# EAGLE design Control_vivero (EAGLE 9.6.1)

## Sheet 1 of 3
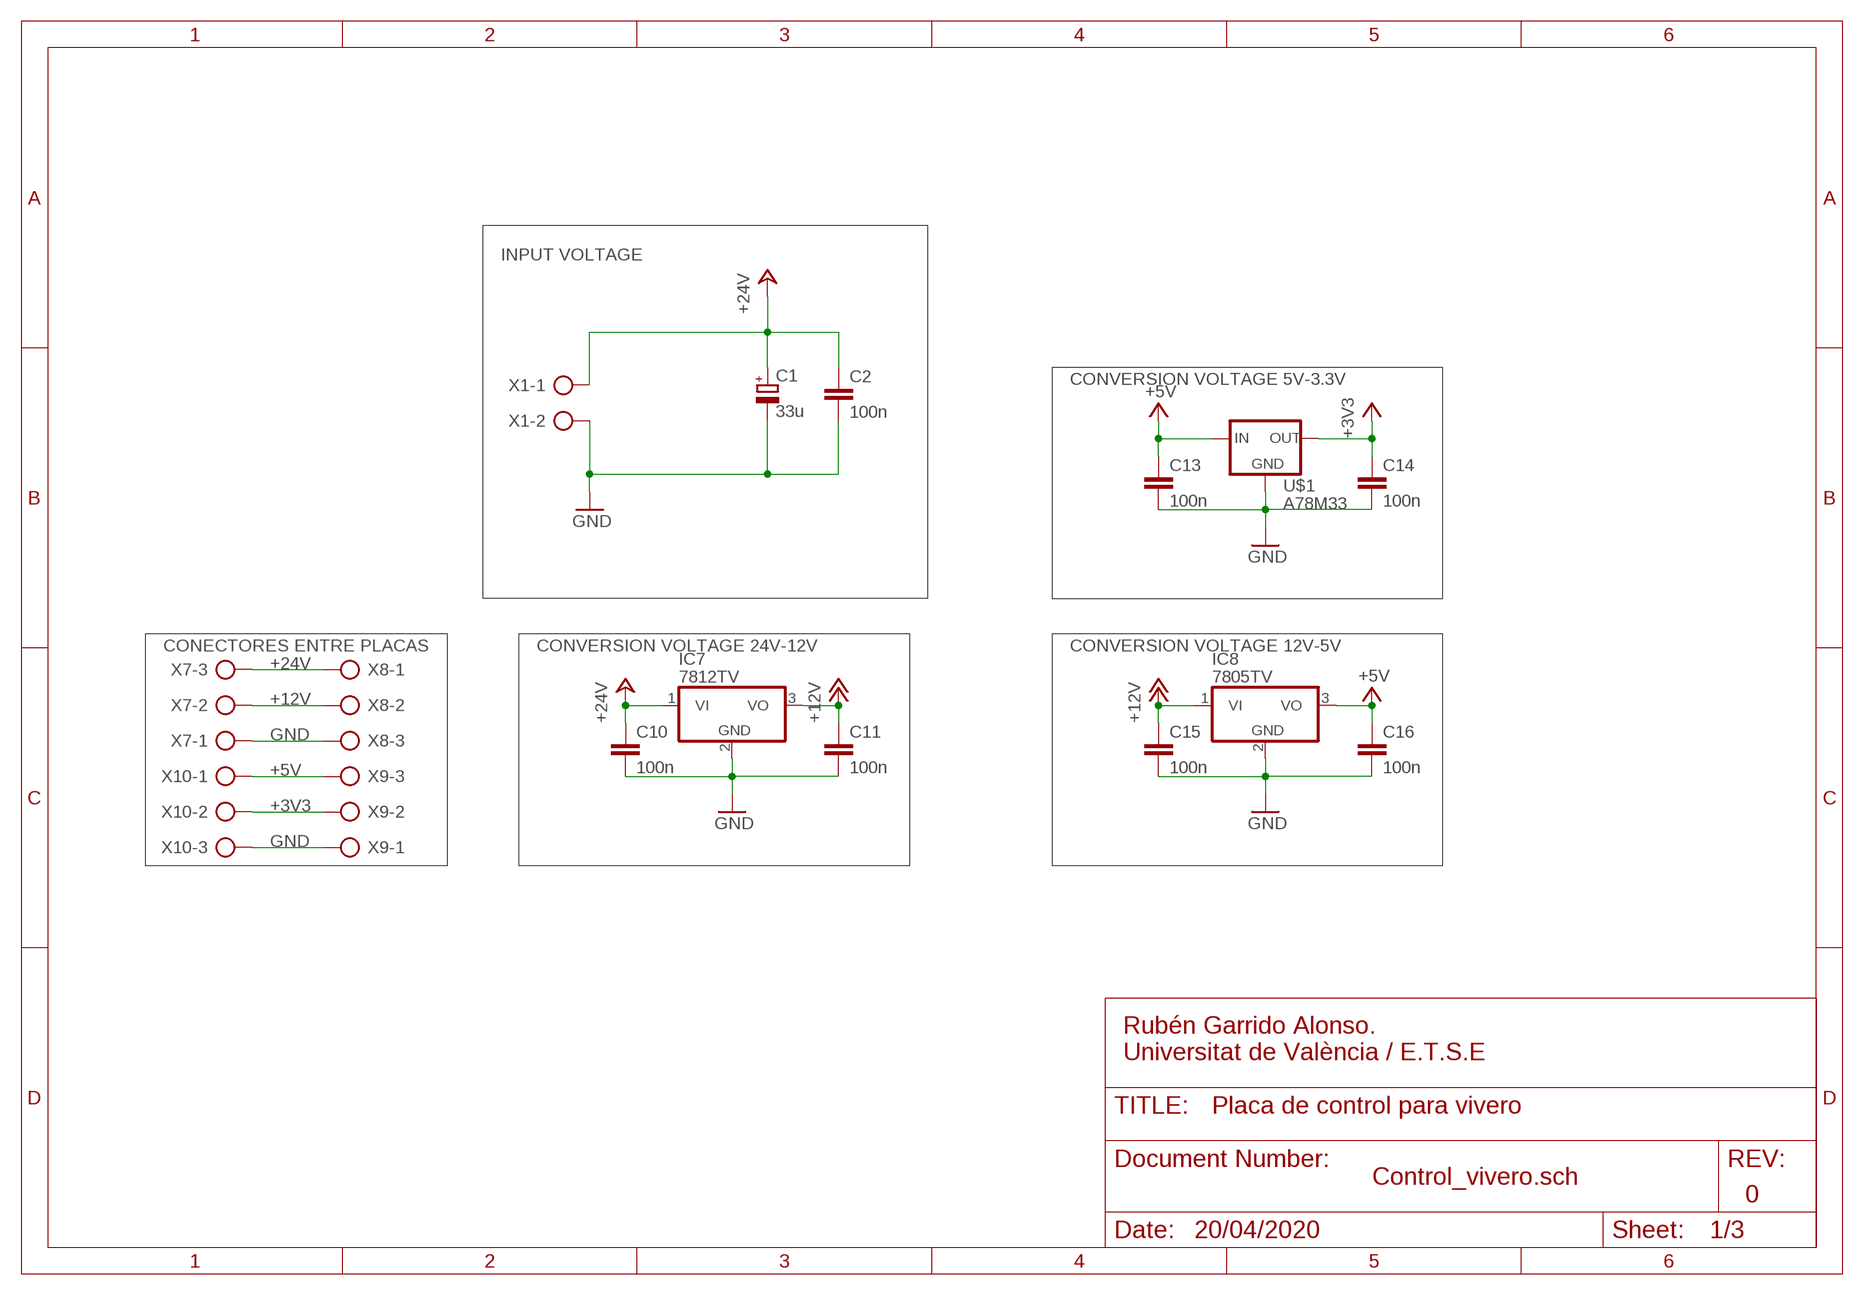
[diagram p0: schematic, sheet 1]

### Parts
C1  33u  CPOL-EUE2.5-7  [E2,5-7]
C2  100n  C-EU050-025X075  [C050-025X075]
C10  100n  C-EU050-025X075  [C050-025X075]
C11  100n  C-EU050-025X075  [C050-025X075]
C13  100n  C-EU050-025X075  [C050-025X075]
C14  100n  C-EU050-025X075  [C050-025X075]
C15  100n  C-EU050-025X075  [C050-025X075]
C16  100n  C-EU050-025X075  [C050-025X075]
IC7  7812TV  [TO220V]
IC8  7805TV  [TO220V]
U$1  A78M33  [TO-252]
X1  AK500/2-H  [AK500/2-H]
X7  AK300/3  [AK300/3]
X8  AK300/3  [AK300/3]
X9  AK300/3  [AK300/3]
X10  AK300/3  [AK300/3]

### Nets
+3V3: C14.1 U$1.OUT X9.2 X10.2 ; also sheet 3
+5V: C13.1 C16.1 IC8.3(VO) U$1.IN X9.3 X10.1 ; also sheet 2
+12V: C11.1 C15.1 IC7.3(VO) IC8.1(VI) X7.2 X8.2 ; also sheet 3
+24V: C1.+ C2.1 C10.1 IC7.1(VI) X1.1 X7.3 X8.1 ; also sheet 3
GND: C1.- C2.2 C10.2 C11.2 C13.2 C14.2 C15.2 C16.2 IC7.2(GND) IC8.2(GND) U$1.COM(GND) X1.2 X7.1 X8.3 X9.1 X10.3 ; also sheet 2,3

### Notes on the sheet
- INPUT VOLTAGE
- CONVERSION VOLTAGE 5V-3.3V
- CONECTORES ENTRE PLACAS | CONVERSION VOLTAGE 24V-12V | CONVERSION VOLTAGE 12V-5V
- Rubén Garrido Alonso.
  Universitat de València / E.T.S.E
- Placa de control para vivero
- Control_vivero.sch
- 0
- 20/04/2020

## Sheet 2 of 3
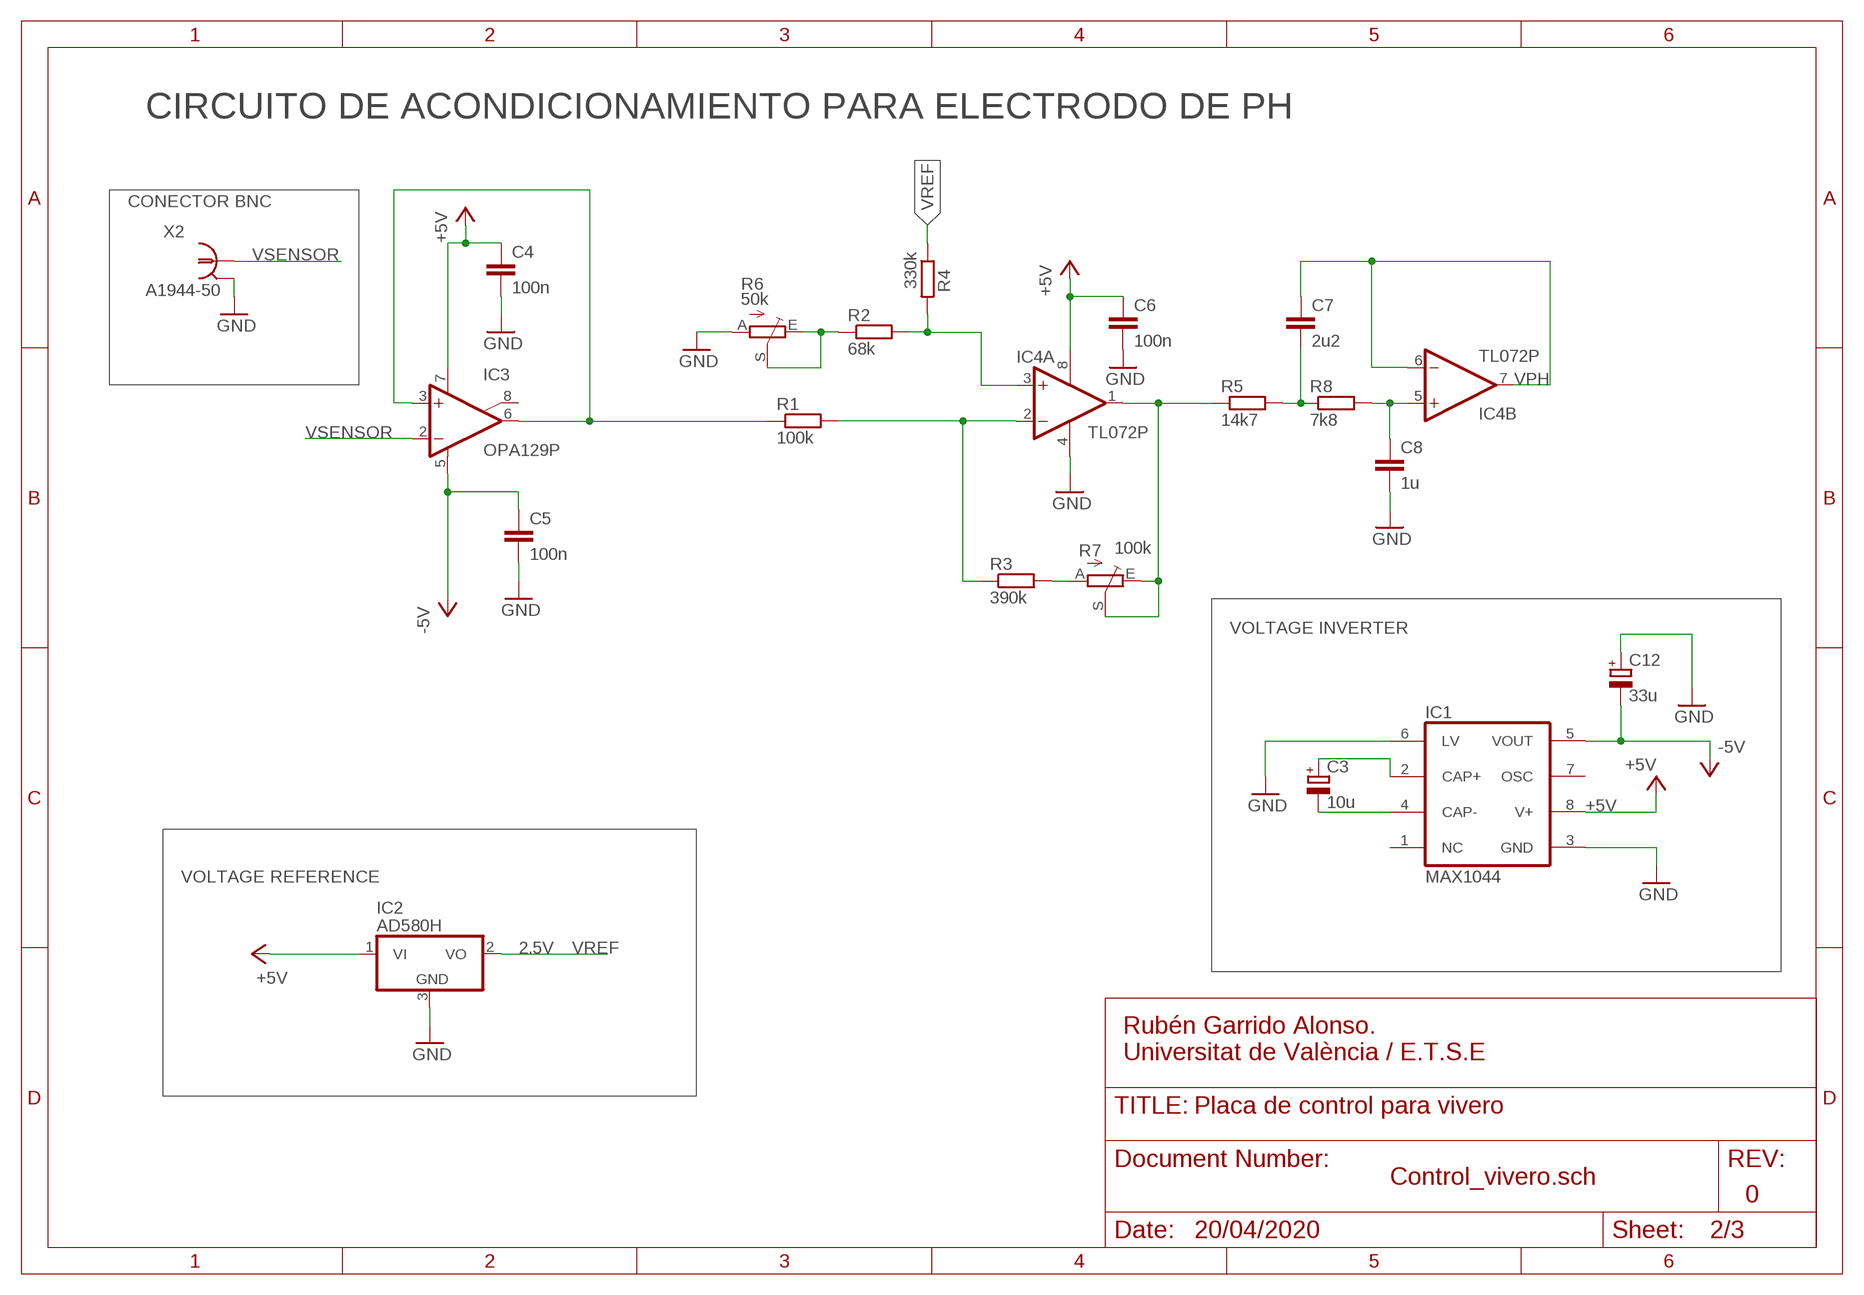
[diagram p1: schematic, sheet 2]

### Parts
C3  10u  CPOL-EUE2,5-6E  [E2,5-6E]
C4  100n  C-EU050-025X075  [C050-025X075]
C5  100n  C-EU050-025X075  [C050-025X075]
C6  100n  C-EU050-025X075  [C050-025X075]
C7  2u2  C-EU050-055X075  [C050-055X075]
C8  1u  C-EU050-055X075  [C050-055X075]
C12  33u  CPOL-EUE2,5-6E  [E2,5-6E]
IC1  MAX1044  [DIL08]
IC2  AD580H  [TO39]
IC3  OPA129P  [DIL08]
IC4  TL072P  [DIL08]
R1  100k  R-EU_0207/10  [0207/10]
R2  68k  R-EU_0207/10  [0207/10]
R3  390k  R-EU_0207/10  [0207/10]
R4  330k  R-EU_0207/10  [0207/10]
R5  14k7  R-EU_0207/10  [0207/10]
R6  50k  TRIM_EU-B25P  [B25P]
R7  100k  TRIM_EU-B25P  [B25P]
R8  7k8  R-EU_0207/10  [0207/10]
X2  A1944-50  [A1944]

### Nets
+5V: C4.1 C6.1 IC1.8(V+) IC2.1(VI) IC3.7(V+) IC4.8(P:V+) ; also sheet 1
-5V: C5.1 C12.- IC1.5(VOUT) IC3.5(V-)
GND: C4.2 C5.2 C6.2 C8.2 C12.+ IC1.3(GND) IC1.6(LV) IC2.3(GND) IC4.4(P:V-) R6.A X2.2 X2.3 X2.4 X2.5 ; also sheet 1,3
N$1: C3.+ IC1.2(CAP+)
N$2: C3.- IC1.4(CAP-)
N$3: R3.2 R7.A
N$4: IC3.3(+IN) IC3.6(OUT) R1.1
N$6: IC4.1(A:OUT) R5.1 R7.E R7.S
N$7: IC4.3(A:+IN) R2.2 R4.2
N$8: R2.1 R6.E R6.S
N$9: C7.2 R5.2 R8.1
N$10: C8.1 IC4.5(B:+IN) R8.2
N$16: IC4.2(A:-IN) R1.2 R3.1
VPH: C7.1 IC4.6(B:-IN) IC4.7(B:OUT) ; also sheet 3
VREF: IC2.2(VO) R4.1
VSENSOR: IC3.2(-IN) X2.1
Unconnected: IC1.1(NC) IC1.7(OSC) IC3.8(SUBS)

### Notes on the sheet
- CIRCUITO DE ACONDICIONAMIENTO PARA ELECTRODO DE PH
- CONECTOR BNC
- VOLTAGE INVERTER
- VOLTAGE REFERENCE
- 2.5V
- Rubén Garrido Alonso.
  Universitat de València / E.T.S.E
- Placa de control para vivero
- Control_vivero.sch
- 0
- 20/04/2020

## Sheet 3 of 3
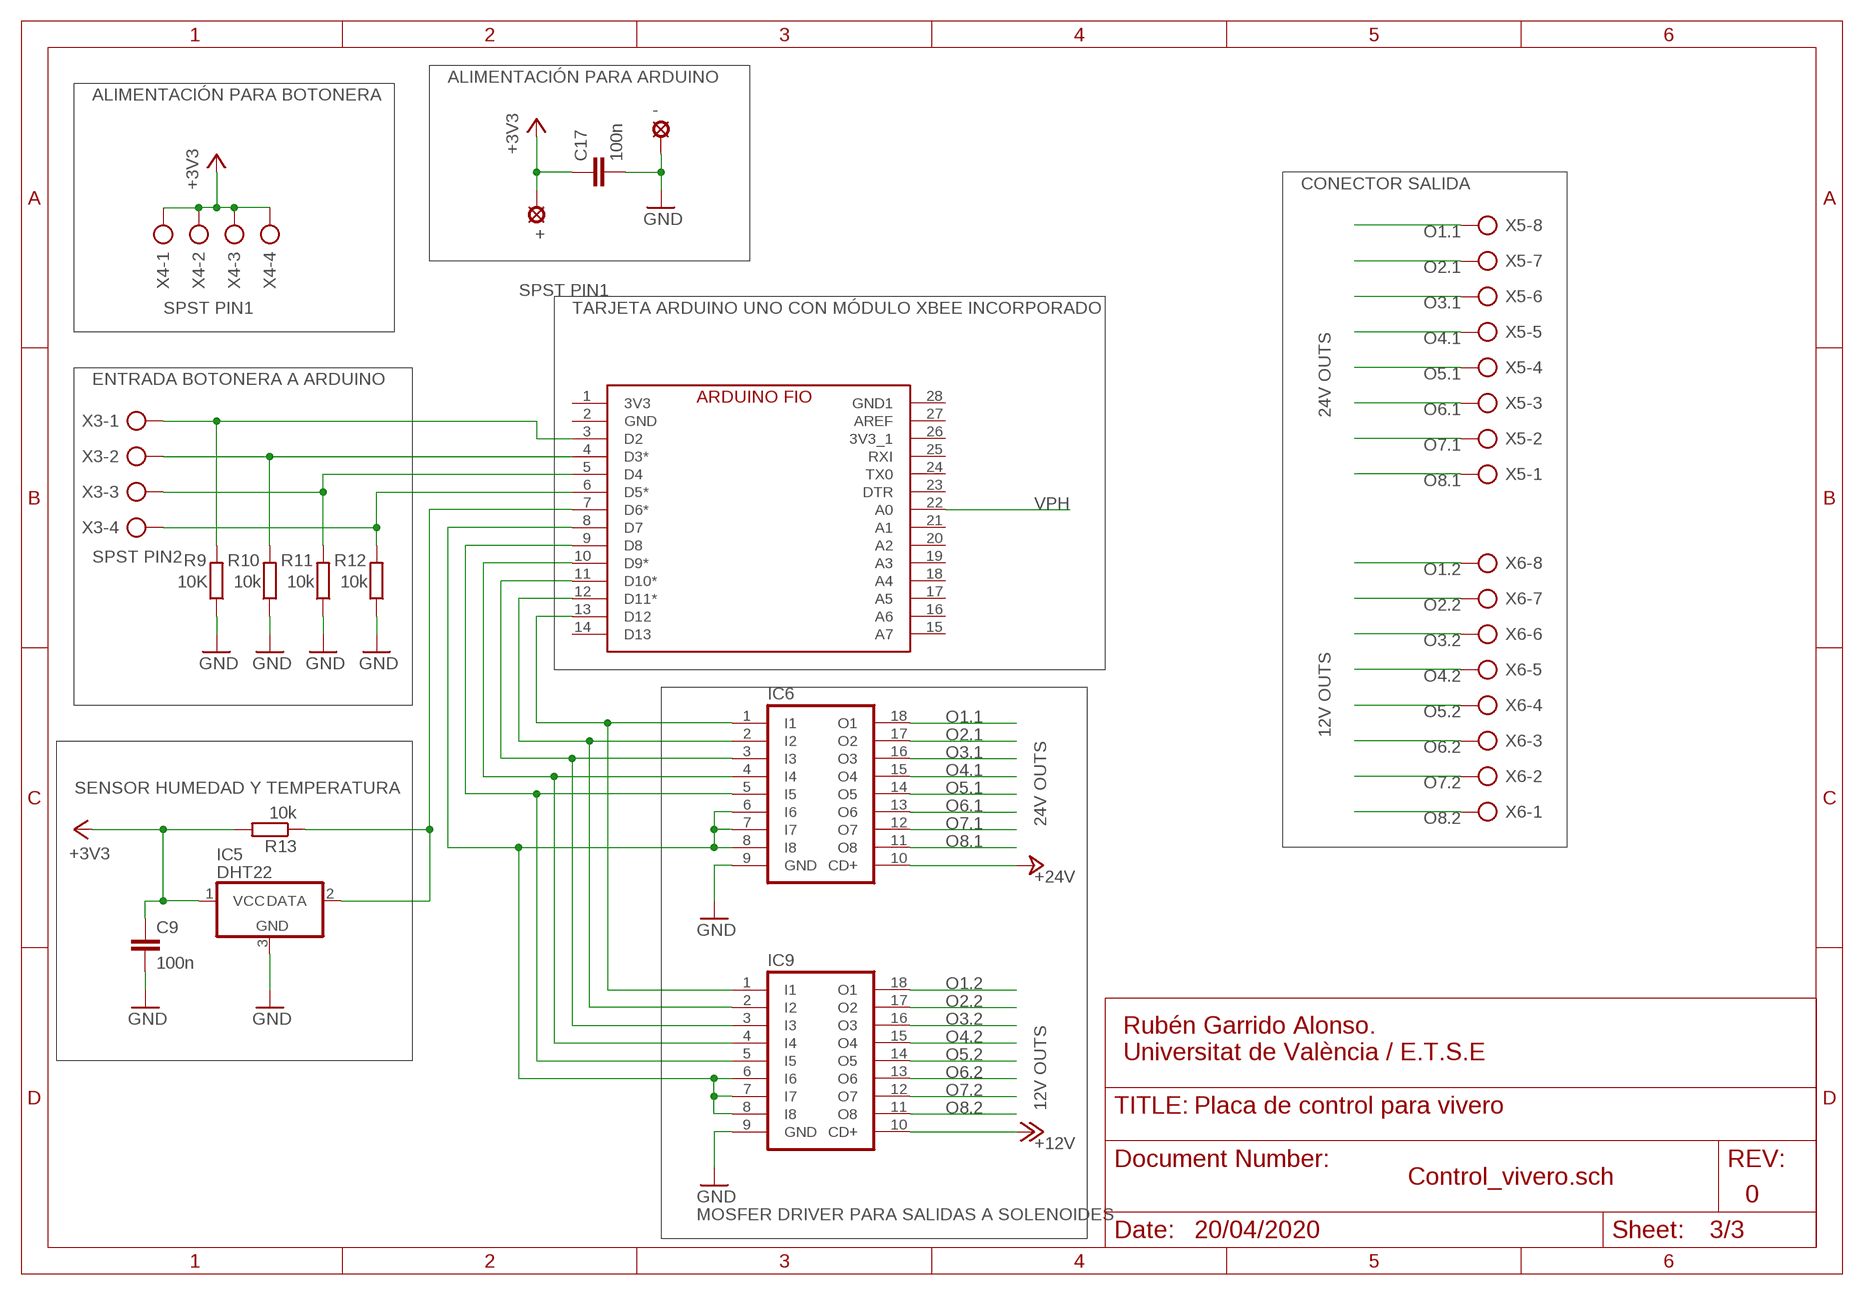
[diagram p2: schematic, sheet 3]

### Parts
+  LSP10  [LSP10]
-  LSP10  [LSP10]
B1  ARDUINO_FIO  [ARDUINO_FIO_SOCKET]
C9  100n  C-EU050-025X075  [C050-025X075]
C17  100n  C-EU050-025X075  [C050-025X075]
IC5  DHT22  [AK300/3]
IC6  ULN2803A  [DIL18]
IC9  ULN2803A  [DIL18]
R9  10K  R-EU_0207/10  [0207/10]
R10  10k  R-EU_0207/10  [0207/10]
R11  10k  R-EU_0207/10  [0207/10]
R12  10k  R-EU_0207/10  [0207/10]
R13  10k  R-EU_0207/10  [0207/10]
X3  AK300/4  [AK300/4]
X4  AK300/4  [AK300/4]
X5  AK300/8  [AK300/8]
X6  AK300/8  [AK300/8]

### Nets
+3V3: +.MP C9.1 C17.1 IC5.1(VCC) R13.2 X4.1 X4.2 X4.3 X4.4 ; also sheet 1
+12V: IC9.10(CD+) ; also sheet 1
+24V: IC6.10(CD+) ; also sheet 1
GND: -.MP C9.2 C17.2 IC5.3(GND) IC6.9(GND) IC9.9(GND) R9.1 R10.1 R11.1 R12.1 ; also sheet 1,2
N$11: B1.3(D2) R9.2 X3.1
N$12: B1.4(D3*) R10.2 X3.2
N$14: B1.5(D4) R11.2 X3.3
N$15: B1.6(D5*) R12.2 X3.4
N$17: B1.7(D6*) IC5.2(DATA) R13.1
N$21: B1.8(D7) IC6.6(I6) IC6.7(I7) IC6.8(I8) IC9.6(I6) IC9.7(I7) IC9.8(I8)
N$22: B1.10(D9*) IC6.4(I4) IC9.4(I4)
N$23: B1.9(D8) IC6.5(I5) IC9.5(I5)
N$25: B1.11(D10*) IC6.3(I3) IC9.3(I3)
N$28: B1.12(D11*) IC6.2(I2) IC9.2(I2)
N$29: B1.13(D12) IC6.1(I1) IC9.1(I1)
O1.1: IC6.18(O1) X5.8
O1.2: IC9.18(O1) X6.8
O2.1: IC6.17(O2) X5.7
O2.2: IC9.17(O2) X6.7
O3.1: IC6.16(O3) X5.6
O3.2: IC9.16(O3) X6.6
O4.1: IC6.15(O4) X5.5
O4.2: IC9.15(O4) X6.5
O5.1: IC6.14(O5) X5.4
O5.2: IC9.14(O5) X6.4
O6.1: IC6.13(O6) X5.3
O6.2: IC9.13(O6) X6.3
O7.1: IC6.12(O7) X5.2
O7.2: IC9.12(O7) X6.2
O8.1: IC6.11(O8) X5.1
O8.2: IC9.11(O8) X6.1
VPH: B1.22(A0) ; also sheet 2
Unconnected: B1.1(3V3) B1.2(GND) B1.14(D13) B1.15(A7) B1.16(A6) B1.17(A5) B1.18(A4) B1.19(A3) B1.20(A2) B1.21(A1) B1.23(DTR) B1.24(TX0) B1.25(RXI) B1.26(3V3_1) B1.27(AREF) B1.28(GND1)

### Notes on the sheet
- ALIMENTACIÓN PARA ARDUINO
- ALIMENTACIÓN PARA BOTONERA
- CONECTOR SALIDA
- SPST PIN1
- SPST PIN1 | TARJETA ARDUINO UNO CON MÓDULO XBEE INCORPORADO
- 24V OUTS
- ENTRADA BOTONERA A ARDUINO
- SPST PIN2
- 12V OUTS
- 24V OUTS
- SENSOR HUMEDAD Y TEMPERATURA
- 12V OUTS
- Rubén Garrido Alonso.
  Universitat de València / E.T.S.E
- Placa de control para vivero
- Control_vivero.sch
- 0
- MOSFER DRIVER PARA SALIDAS A SOLENOIDES
- 20/04/2020

## Library data of the parts
+ - = solpad:LSP10: SOLDER PAD drill 1.0 mm, distributor Buerklin, 12H555
B1 = Componentes_PCB_vivero:ARDUINO_FIO
C1 C3 C12 = rcl:CPOL-EU: POLARIZED CAPACITOR, European symbol; SPICEPREFIX: C
C2 C4-C11 C13-C17 = rcl:C-EU: CAPACITOR, European symbol; SPICEPREFIX: C
IC1 = Componentes_PCB_vivero:MAX1044: VOLTAGE CONVERTER; MF: INTERSIL; MPN: ICL7660CPA; OC_FARNELL: 1018170; OC_NEWARK: 06F7441
IC2 = Componentes_PCB_vivero:AD580H: VOLTAGE REFERENCE 2.5 V
IC3 = burr-brown:OPA129: Difet Operational Amplifier Ultra-Low Bias Current; OC_FARNELL: unknown; OC_NEWARK: unknown
IC4 = linear:TL072: OP AMP
IC5 = Componentes_PCB_vivero:DHT22: VOLTAGE REFERENCE 2.5 V
IC6 IC9 = uln-udn:ULN2803A: DRIVER ARRAY
IC7 IC8 = linear:78*: Positive VOLTAGE REGULATOR Source: http://cache.national.com/ds/LM/LM78L05.pdf http://www.fairchildsemi.com/ds/LM/LM7805.pdf
R1-R5 R8-R13 = rcl:R-EU_: RESISTOR, European symbol; SPICEPREFIX: R
R6 R7 = pot:TRIM_EU-: POTENTIOMETER
U$1 = Componentes_PCB_vivero:A78M33
X1 = con-ptr500:AK500/2-H: CONNECTOR Aug. 2004 / PTR Meßtechnik: Die Bezeichnung der Serie AK505 wurde geändert. Es handelt sich hierbei um AK500 in horizontaler Ausführung.; OC_FARNELL: unknown; OC_NEWARK: unknown
X2 = con-coax:A1944-50: BNC CONNECTOR 50 Ohm distributor Buerklin 78F2475; OC_FARNELL: unknown; OC_NEWARK: unknown
X3 X4 = con-ptr500:AK300/4: CONNECTOR; OC_FARNELL: unknown; OC_NEWARK: unknown
X5 X6 = con-ptr500:AK300/8: CONNECTOR; OC_FARNELL: unknown; OC_NEWARK: unknown
X7-X10 = con-ptr500:AK300/3: CONNECTOR; OC_FARNELL: unknown; OC_NEWARK: unknown

## Board
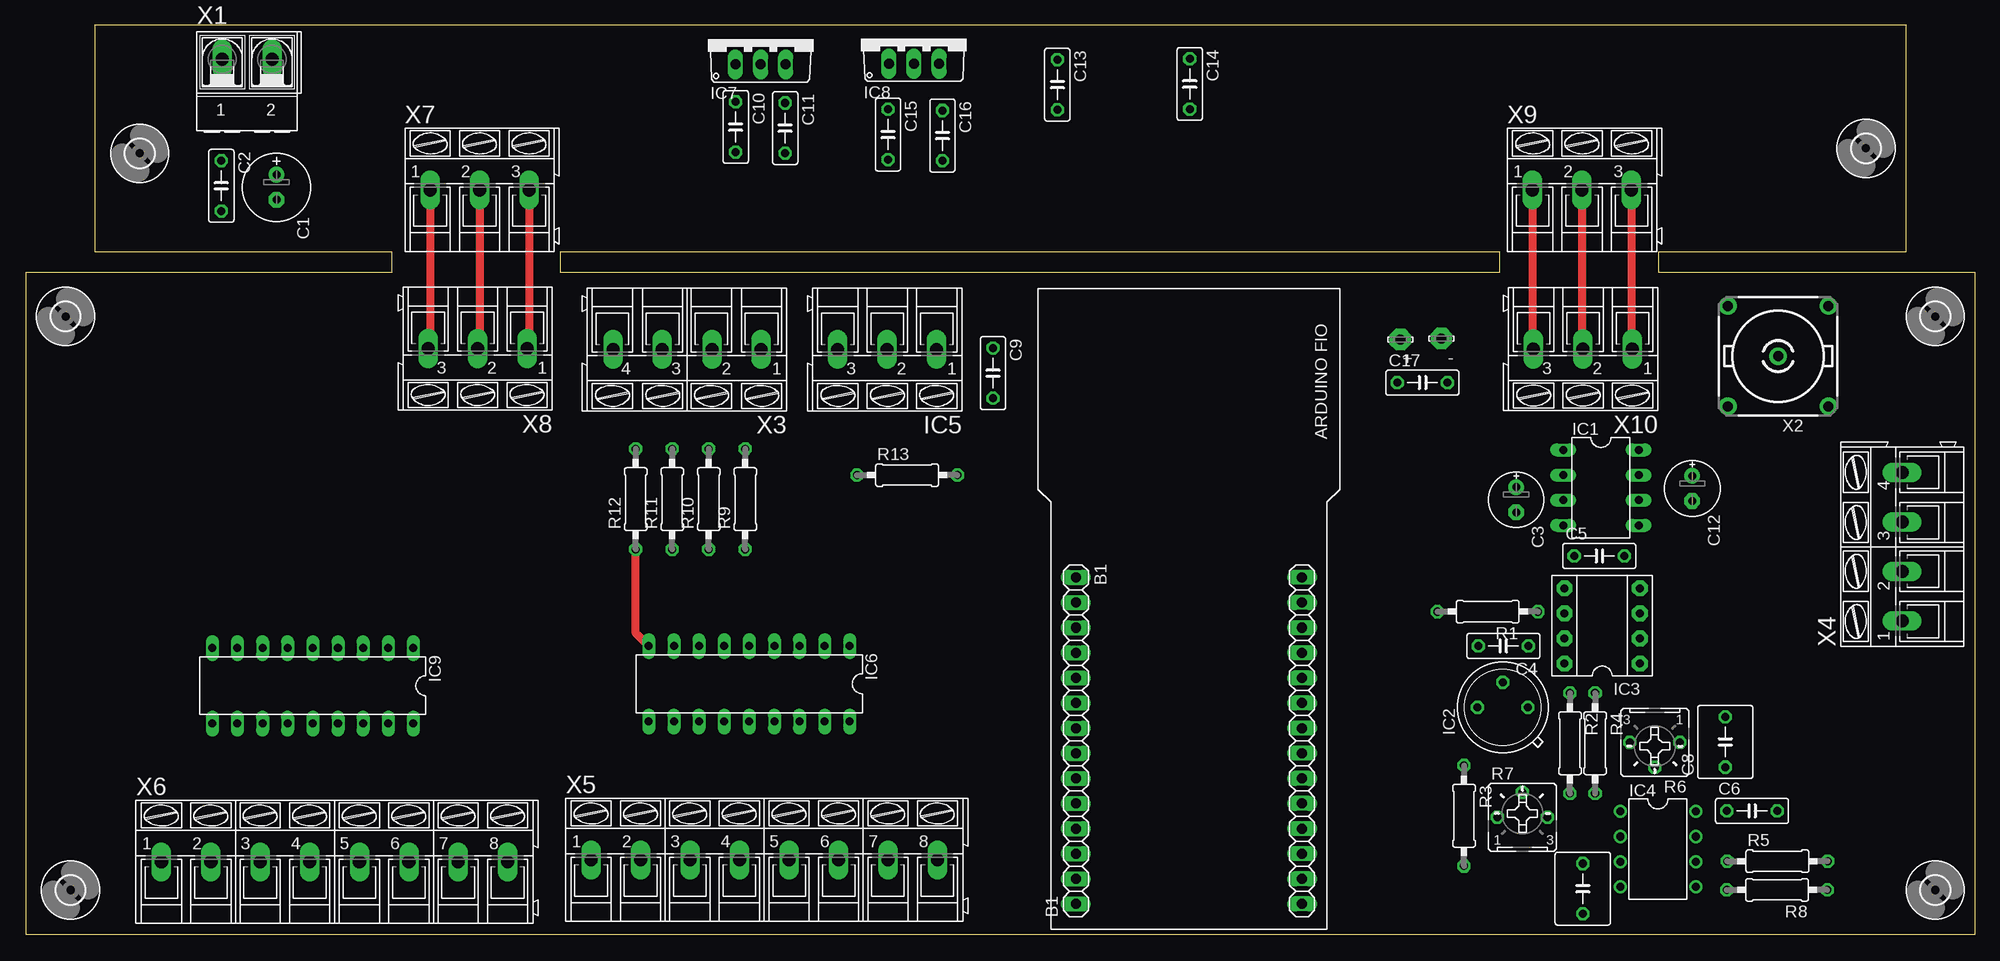
[diagram p3: board, top side]
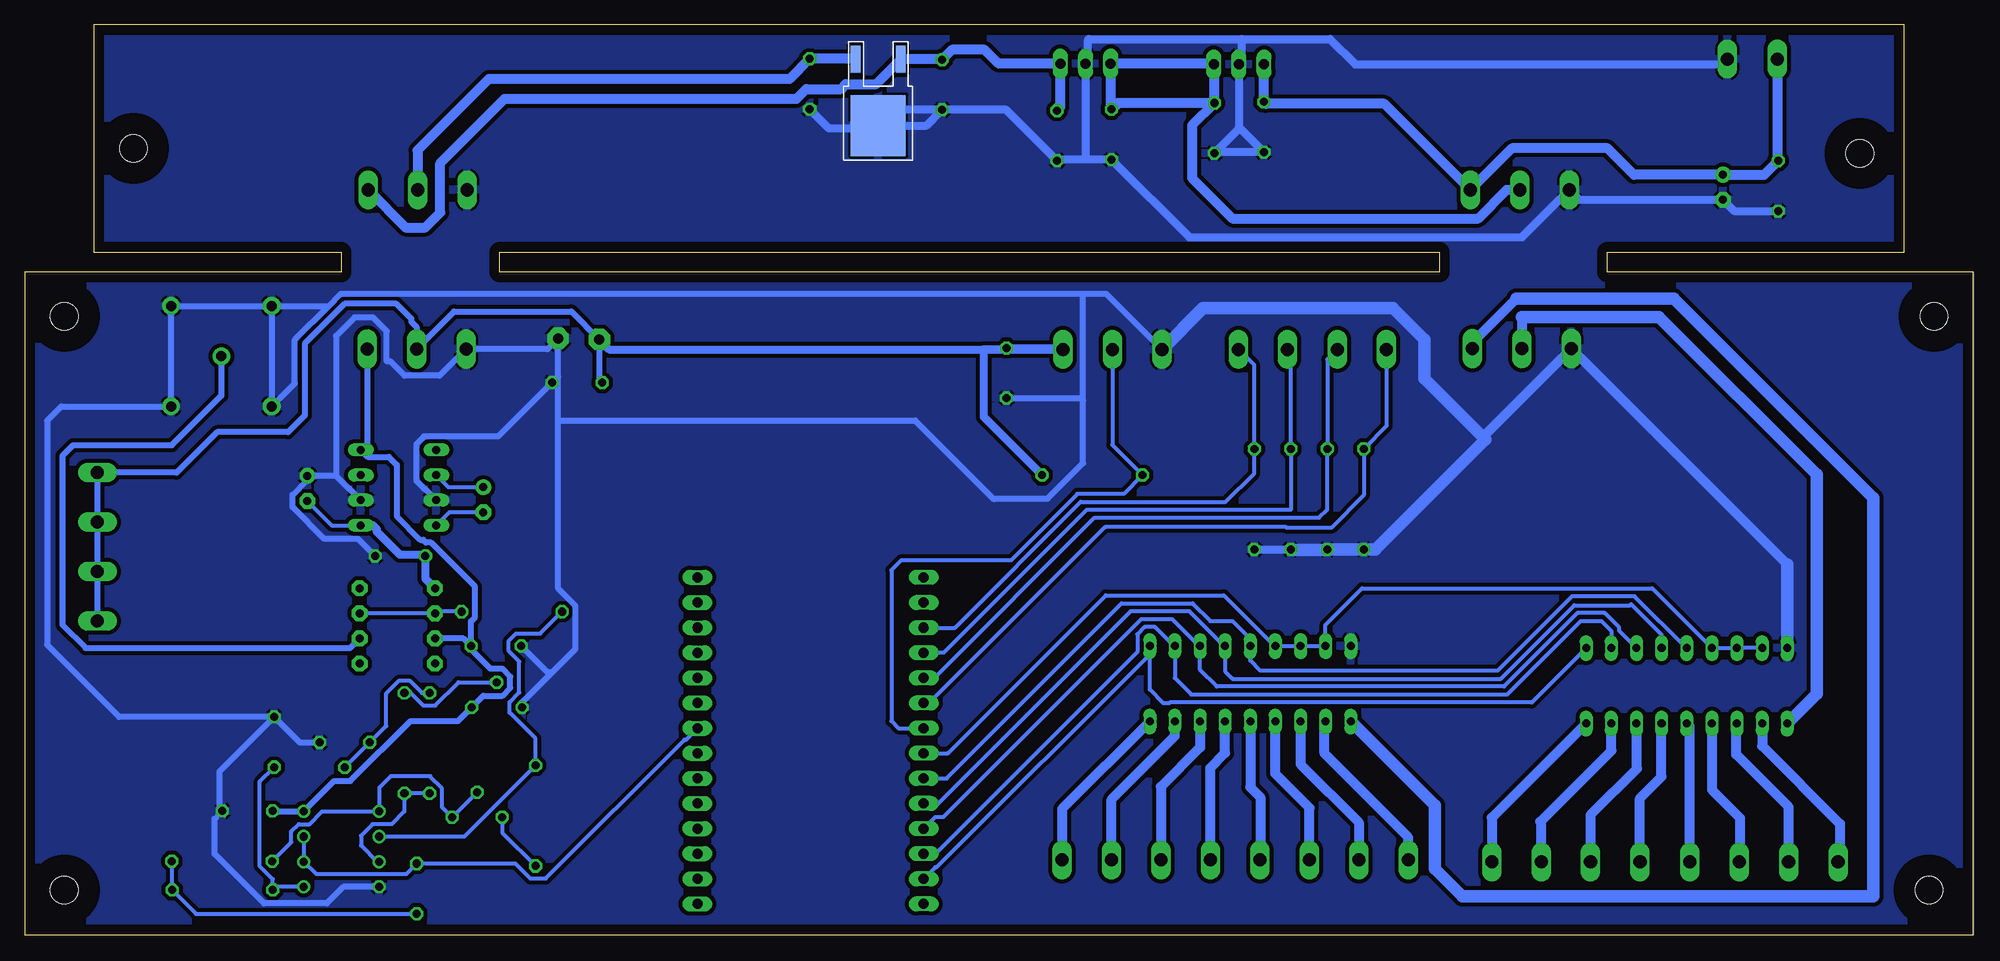
[diagram p4: board, bottom side, seen from below]

Size 197 x 92 mm. Coordinates in mm from the lower left corner, seen from the top.
Outline: 7,69 7,92 190,92 190,69 165,69 165,67 197,67 197,0 0,0 0,67 37,67 37,69 7,69
Outline: 54,67 149,67 149,69 54,69 54,67
Copper layers (1*16): Top 0.035mm / dielectric 1.5mm / Bottom 0.035mm
Design rules "default *": minimum track width 0.4mm, minimum drill 0.35mm, track to track 0.4mm, track to pad 0.4mm, pad to pad 0.4mm, via to via 6mil, smd to smd 6mil, copper to edge 40mil, drill to drill 6mil, minimum pad ring 10mil, minimum via ring 8mil, stop-mask expansion 4mil, vias tented up to drill 0mil, thermal gap 10mil

### Footprints (pad centres in the part's own frame; a part is rotated, then mirrored left to right if it is on the bottom)
LSP10 = drill 1.016 pad 2.159 octagon: MP 0,0
ARDUINO_FIO_SOCKET = drill 1.016 long: 1 16.51,22.86; 2 13.97,22.86; 3 11.43,22.86; 4 8.89,22.86; 5 6.35,22.86; 6 3.81,22.86; 7 1.27,22.86; 8 -1.27,22.86; 9 -3.81,22.86; 10 -6.35,22.86; 11 -8.89,22.86; 12 -11.43,22.86; 13 -13.97,22.86; 14 -16.51,22.86; 15 -16.51,0; 16 -13.97,0; 17 -11.43,0; 18 -8.89,0; 19 -6.35,0; 20 -3.81,0; 21 -1.27,0; 22 1.27,0; 23 3.81,0; 24 6.35,0; 25 8.89,0; 26 11.43,0; 27 13.97,0; 28 16.51,0
E2,5-7 = drill 0.813 pad 1.6: + -1.27,0 | drill 0.813 pad 1.6 octagon: - 1.27,0
C050-025X075 = drill 0.813 octagon: 1 -2.54,0; 2 2.54,0
E2,5-6E = drill 0.813 pad 1.575: + -1.27,0 | drill 0.813 pad 1.575 octagon: - 1.27,0
C050-055X075 = drill 0.813 octagon: 1 -2.54,0; 2 2.54,0
DIL08 = drill 0.813 long: 1 -3.81,-3.81; 2 -1.27,-3.81; 3 1.27,-3.81; 4 3.81,-3.81; 5 3.81,3.81; 6 1.27,3.81; 7 -1.27,3.81; 8 -3.81,3.81
TO39 = drill 0.813 octagon: 1 0,-2.54; 2 2.54,0; 3 0,2.54
DIL08' = drill 0.813 pad 1.6 octagon: 1 -3.81,-3.81; 2 -1.27,-3.81; 3 1.27,-3.81; 4 3.81,-3.81; 5 3.81,3.81; 6 1.27,3.81; 7 -1.27,3.81; 8 -3.81,3.81
DIL08'' = drill 0.813 pad 1.27: 1 -3.81,-3.81; 2 -1.27,-3.81; 3 1.27,-3.81; 4 3.81,-3.81; 5 3.81,3.81; 6 1.27,3.81; 7 -1.27,3.81; 8 -3.81,3.81
AK300/3 = drill 1.321 long: 1 -5.004,0; 2 0,0; 3 5.004,0
DIL18 = drill 0.813 long: 1 -10.16,-3.81; 2 -7.62,-3.81; 3 -5.08,-3.81; 4 -2.54,-3.81; 5 0,-3.81; 6 2.54,-3.81; 7 5.08,-3.81; 8 7.62,-3.81; 9 10.16,-3.81; 10 10.16,3.81; 11 7.62,3.81; 12 5.08,3.81; 13 2.54,3.81; 14 0,3.81; 15 -2.54,3.81; 16 -5.08,3.81; 17 -7.62,3.81; 18 -10.16,3.81
TO220V = drill 1.016 long: 1 -2.54,-2.54; 2 0,-2.54; 3 2.54,-2.54
0207/10 = drill 0.813 octagon: 1 -5.08,0; 2 5.08,0
B25P = drill 0.813 octagon: A -2.54,0; E 2.54,0; S 0,2.54
TO-252 = smd 6.15 x 5.55: COM 0,0 | smd 2.75 x 1: IN -6.7,2.29; OUT -6.7,-2.29
2,8 = hole 2.8: 0,0
AK500/2-H = drill 1.321 long: 1 -2.515,0; 2 2.515,0
A1944 = drill 1.016 pad 1.778: 1 0,0; 2 5.08,5.08; 3 -5.08,5.08; 4 -5.08,-5.08; 5 5.08,-5.08
AK300/4 = drill 1.321 long: 1 -7.493,0; 2 -2.515,0; 3 2.515,0; 4 7.493,0
AK300/8 = drill 1.321 long: 1 -17.501,0; 2 -12.497,0; 3 -7.518,0; 4 -2.515,0; 5 2.515,0; 6 7.518,0; 7 12.497,0; 8 17.501,0

### Placement (x,y rotation side)
+  138.92,60.18 180 top
-  143.08,60.28 180 top
B1  128.99,19.6 90 top
C1  25.32,75.56 270 top
C2  19.75,75.71 270 top
C3  150.64,43.97 270 top
C4  149.35,29.18 180 top
C5  159.04,38.28 0 top
C6  174.48,12.5 0 top
C7  157.37,4.64 270 top
C8  171.78,19.47 90 top
C9  97.75,56.77 270 top
C10  71.75,81.66 270 top
C11  76.75,81.55 270 top
C12  168.44,45.11 270 top
C13  104.25,85.94 270 top
C14  117.64,86.01 270 top
C15  87.14,80.9 270 top
C16  92.64,80.79 270 top
C17  141.16,55.8 0 top
IC1  159.21,45.19 270 top
IC2  149.28,22.97 90 top
IC3  OPA129P  [DIL08']  159.34,31.21 90 top
IC4  TL072P  [DIL08'']  164.97,8.64 270 top
IC5  87.06,59.17 180 top
IC6  73.11,25.36 180 top
IC7  74.26,90.53 0 top
IC8  89.76,90.6 0 top
IC9  28.99,25.16 180 top
R1  147.76,32.65 180 top
R2  156.08,19.34 270 top
R3  145.37,12.01 270 top
R4  158.62,19.34 270 top
R5  177.05,7.42 0 top
R6  164.65,19.43 180 top
R7  151.27,11.86 0 top
R8  177.01,4.52 180 top
R9  72.71,44.03 90 top
R10  69.02,44.03 90 top
R11  65.33,44.03 90 top
R12  61.64,44.03 90 top
R13  89.07,46.45 0 top
U$1  110.73,81.8 270 bottom
U$2  [2,8]  186,79.5 0 top
U$3  [2,8]  11.5,79 0 top
U$4  [2,8]  4.5,4.5 0 top
U$5  [2,8]  193,4.5 0 top
U$6  [2,8]  4,62.5 0 top
U$7  [2,8]  193,62.5 0 top
X1  22.35,88.52 0 top
X2  177.12,58.48 180 top
X3  66.82,59.17 180 top
X4  189.66,39.21 90 top
X5  74.63,7.55 0 top
X6  31.19,7.35 0 top
X7  45.85,75.3 0 top
X8  45.65,59.25 180 top
X9  157.3,75.3 0 top
X10  157.4,59.2 180 top

### Tracks (layer width: path | path; a pad name or v marks a point on that pad's centre or on a via)
+3V3
  Top 0.813: X9.2 157.3,59.3 X10.2
  Bottom 0.6: 157.9,61.95 157.9,62.24 159.45,63.8 164.63,63.8 168.69,59.74 168.69,59.41 | C17.1 138.92,56.1 +.MP 141.74,63 153.6,63 X10.2
  Bottom 0.61: 157.9,61.95 157.4,61.45 X10.2 | 168.69,59.41 168.69,52.5 170.38,50.81 177.56,50.81 181.66,46.7 X4.4 X4.3 X4.2 X4.1
  Bottom 0.8: X4.3 189.66,41.31
  Bottom 0.813: R13.2 100.06,52.36 100.06,59.17 IC5.1 | +.MP 137.91,59.17 IC5.1 | C9.1 92.2,59.31 IC5.1
  Bottom 1.016: U$1.OUT 113.07,88.55 C14.1 119.69,86.5 150.1,86.5 157.3,79.3 X9.2
+5V
  Top 0.813: X9.3 162.3,59.3 X10.1
  Bottom 0.6: X10.1 162.4,49.62
  Bottom 0.61: C6.1 171.89,12.45 IC4.8 165.71,15.53 164.09,15.53 158.01,21.6 153.19,21.6 IC2.1 150.65,24.14 148.72,24.14 147.91,24.95 147.91,26.07 148.72,26.88 149.93,26.88 151.89,28.84 C4.1 | 162.4,49.62 IC1.8 162.32,48.3 160.2,48.3 159.4,47.5 159.4,42.3 157.01,39.91 156.71,39.91 156.44,39.65 155.94,39.65 151.47,35.19 151.47,32.09 151.89,31.67 C4.1 | C4.1 152.65,29.94 IC3.7
  Bottom 1.016: C16.1 92.3,83.67 IC8.3 98.56,88.06 99.95,89.45 103.28,89.45 C13.1 104.27,88.5 U$1.IN 110.94,86 114,86 114.5,85.5 118,85.5 119,84.5 148.5,84.5 155,78 155,73 156.5,71.5 158.5,71.5 X9.3
+12V
  Top 0.813: X7.2 45.85,59.45 X8.2
  Bottom 1.016: 45.65,62.45 X8.2 | C11.1 76.8,84.14 IC7.3 76.87,88.06 IC8.1 87.22,83.52 C15.1 86.49,84.09 C11.1 | C11.1 79,81.84 79,76.5 74.91,72.41 50.07,72.41 47.18,75.3 X7.2
  Bottom 1.27: IC9.10 15.85,24.33 15.85,46.5 31.8,62.45 45.65,62.45
+24V
  Top 0.813: X7.3 50.85,59.45 X8.1
  Bottom 1.016: 46.19,64.32 50.65,59.86 X8.1 | X1.1 19.84,78.33 C2.1 21.17,76.83 C1.+ 34.33,76.83 37,79.5 46.65,79.5 X7.3 59.55,84 71.55,84 C10.1 71.72,84.23 IC7.1
  Bottom 1.27: 46.19,64.32 30.31,64.32 10.15,44.16 10.15,3.85 51.65,3.85 54.45,6.65 54.45,13.05 IC6.10
-5V
  Bottom 0.4: C12.- 165.98,41.38 IC1.5
  Bottom 0.813: IC3.5 156.5,35.99 C5.1 156.62,38.4 159.05,38.4 161.4,40.75 161.4,41 161.78,41.38 IC1.5
GND
  Top 0.813: X9.1 152.3,59.3 X10.3 | X7.1 40.85,59.45 X8.3 | IC6.9 61.64,30.48 R12.1
  Bottom 0.6: 165.53,46.38 165.53,60.52 163.65,62.4 161.8,62.4 160.4,61 160.4,57.95 160.03,57.95 158.6,56.52 155.08,56.52 X10.3 144.16,59.2 -.MP | 159,64.8 90,64.8 | 90,64.8 87.69,64.8 IC5.3 | 143.08,52 107,52 99,44 98.91,44.09 93.59,44.09 90,47.68 90,54 | 90,54 90,64.8 | C9.2 90.23,54.23 90,54
  Bottom 0.61: IC4.4 164.79,4.83 166.47,3.15 172.81,3.15 177.8,8.15 177.8,11.72 177.34,12.19 | 177.34,12.19 C6.2 | C8.2 169.2,19.43 R6.A | C8.2 177.34,16.45 177.34,12.19 | C8.2 187.46,22.01 194.75,29.3 194.75,51.95 193.3,53.4 X2.3 X2.4 X2.5 | X2.5 X2.2 169.7,55.74 169.7,60.15 166.29,63.56 | IC1.6 164.19,45.09 164.25,45.09 165.53,46.38 C12.+ 168.44,45.95 169.93,44.46 169.93,43.22 166.72,40.02 163.31,40.02 C5.2 | 158.5,64.8 159,64.8 165.05,64.8 166.29,63.56 | C17.2 143.08,56.42 | 143.08,56.42 -.MP | C17.2 149.13,50.37 156.63,50.37 157.43,49.56 157.43,45.9 156.63,45.09 156.57,45.09 IC1.3 | IC2.3 146.74,23.47 143.66,26.56 | 144.27,55.23 C17.2 | 143.08,56.42 143.08,52 143.08,34.98 141.31,33.22 141.31,28.9 143.66,26.56 | C4.2 144.19,26.56 143.66,26.56 | X2.5 166.29,63.56
  Bottom 0.813: C14.2 115.67,81.5 113.5,81.5 111.6,83.4 C13.2 | C13.2 97.79,83.4 C16.2 92.53,78.36 89.5,78.36 | 89.5,78.36 C15.2 79.28,70.5 45.65,70.5 X7.1 39.84,74.29 C1.- 24.2,73.17 C2.2 | 89.5,78.36 89.76,78.62 IC8.2 89.5,88.32 89.5,90.5 89.45,90.55 74,90.55 | 74,90.55 74,88.25 IC7.2 74.26,81.63 | 74.26,81.63 C10.2 76.64,79.12 | 76.64,79.12 C11.2 | 74.26,81.63 74.26,81.5 76.64,79.12 | 74,90.55 65.05,90.55 62.5,88 25.39,88 | 25.39,88 24.5,88 | U$1.COM 105.85,81.8 C13.2 | R9.1 68.98,38.95 68.93,38.9 | R10.1 65.37,38.95 | R11.1 R12.1 | X1.2 25.39,88
  Bottom 1.016: 49.6,50.3 X8.3 18.83,37.43
  Bottom 1.27: 68.93,38.9 65.42,38.9 65.37,38.95 R12.1 60.45,38.95 49.35,50.05 49.6,50.3 55.5,56.2 55.5,60.15 58.7,63.35 77.88,63.35 IC5.3 | IC9.9 18.83,37.43
  pour Bottom: 7,92 191,92 191,69 197,69 198,68 198,0 0,0 0,67 6,67 7,68
N$1
  Bottom 0.4: IC1.2 154.18,45.24 C3.+
N$2
  Bottom 0.4: C3.- 154.08,42.7 IC1.4
N$3
  Bottom 0.4: R7.A 148.73,10.29 R3.2
N$4
  Bottom 0.4: IC3.3 IC3.6 155.59,32.42 155.88,32.42 155.65,32.65 R1.1
N$6
  Bottom 0.4: R7.S R7.E 154.82,12.87 154.82,14.78 156,15.96 156,16 160,16 161.16,14.84 IC4.1 166.94,12.45 168.22,11.17 169.3,11.17 170.04,10.43 170.04,9.35 R5.1
N$7
  Bottom 0.4: R2.2 R4.2 158.62,12.45 159.9,11.17 161.83,11.17 163,10 163,9 161.37,7.37 IC4.3
N$8
  Bottom 0.4: R6.S R6.E 160.45,21.09 160.45,24.37 159.14,25.68 158.1,25.68 156.84,24.42 R2.1
N$9
  Bottom 0.4: R5.2 182.13,4.56 R8.1 179.67,2.1 C7.2
N$10
  Bottom 0.4: IC4.5 171.62,4.83 R8.2 171.93,5.6 173.23,6.9 173.23,15.48 C8.1
N$11
  Bottom 0.4: B1.3 102.97,31.03 90.25,43.75 75.6,43.75 72.71,46.64 R9.2 72.71,57.57 X3.1
N$12
  Bottom 0.4: B1.4 104.11,28.49 89.65,42.95 69.02,42.95 R10.2 | R10.2 69.02,58.85 X3.2 | 69.02,49.02 R10.2
N$14
  Bottom 0.4: B1.5 105.05,25.95 88.85,42.15 66.15,42.15 65.33,42.97 R11.2 65.33,58.15 X3.3
N$15
  Bottom 0.4: B1.6 105.59,23.41 87.79,41.21 69.5,41.21 69.42,41.13 64.93,41.13 61.64,44.42 R12.2 59.33,51.42 X3.4
N$16
  Bottom 0.4: IC4.2 152.55,9.91 R3.1 145.37,19.82 148,22.45 148,23.49 147.01,24.48 147.01,27.6 148.07,28.66 148.07,29.7 147.33,30.44 144.89,30.44 R1.2
N$17
  Bottom 0.4: IC5.2 87.06,49.52 R13.1 85.89,44.55 90.58,44.55 97.28,37.85 108.4,37.85 109.4,36.85 109.4,21.6 108.67,20.87 B1.7
N$21
  Bottom 0.4: IC9.8 IC9.7 IC9.6 32.48,35 61.8,35 65.49,31.31 IC6.8 | IC6.8 IC6.7 IC6.6 70.67,29.17 75.79,34.29 87.71,34.29 103.67,18.33 B1.8 | 65.39,29.17 IC6.8
N$22
  Bottom 0.4: IC9.4 31.53,30.33 34.6,33.4 34.7,33.3 40.36,33.3 47.79,25.87 74.9,25.87 75.65,26.62 IC6.4 75.75,29.17 79.27,32.69 85.21,32.69 104.8,13.1 105.98,13.1 B1.10
N$23
  Bottom 0.4: IC9.5 29.04,28.97 34.27,34.2 40.59,34.2 48.12,26.67 72.07,26.67 73.11,27.71 IC6.5 | IC6.5 73.21,29.17 | B1.9 103.81,15.79 86.11,33.49 78.94,33.49 77.15,31.7 74.9,31.7 73.11,29.91 IC6.5
N$25
  Bottom 0.4: IC9.3 35.81,30.71 35.81,31.04 37.27,32.5 40.03,32.5 47.46,25.07 76.5,25.07 78.19,26.76 IC6.3 78.29,29.17 81.01,31.89 84.12,31.89 104.13,11.89 104.95,11.89 B1.11
N$28
  Bottom 0.4: IC9.2 36.61,30.71 37.6,31.7 39.7,31.7 47.13,24.27 79.07,24.27 80.73,25.93 IC6.2 80.83,29.17 82.75,31.09 83.79,31.09 84.53,30.35 84.53,28.57 104.93,8.17 B1.12
N$29
  Bottom 0.4: IC9.1 44.65,23.47 81.25,23.47 81.32,23.4 81.9,23.4 83.27,24.77 IC6.1 83.27,28.34 104.8,6.81 104.95,6.81 B1.13
O1.1
  Bottom 1: IC6.18 92.13,12.69 X5.8
O1.2
  Bottom 1: IC9.18 48.69,11.81 X6.8
O2.1
  Bottom 1: X5.7 87.13,13.67 80.73,20.07 IC6.17
O2.2
  Bottom 1: X6.7 43.69,11.29 43.8,11.4 36.6,18.6 IC9.17
O3.1
  Bottom 1: IC6.16 78.19,18.91 82.15,14.95 X5.6
O3.2
  Bottom 1: IC9.16 34.07,16.87 34,16.8 38.71,12.09 X6.6
O4.1
  Bottom 1: X5.5 77.14,16.86 75.65,18.35 IC6.15
O4.2
  Bottom 1: X6.5 33.7,13.79 31.53,15.97 IC9.15
O5.1
  Bottom 1: IC6.14 73.11,14.91 72.1,13.9 72.1,7.57 X5.4
O5.2
  Bottom 1: X6.4 28.68,21.04 IC9.14
O6.1
  Bottom 1: X5.3 67.11,12.81 70.57,16.27 IC6.13
O6.2
  Bottom 1: IC9.13 26.45,14.65 23.6,11.8 23.6,7.42 X6.3
O7.1
  Bottom 1: IC6.12 68.03,17.23 62.13,11.33 X5.2
O7.2
  Bottom 1: X6.2 18.69,12.89 24,18.2 24,21.26 IC9.12
O8.1
  Bottom 1: X5.1 57.13,9.83 65.6,18.3 65.6,21.44 IC6.11
O8.2
  Bottom 1: IC9.11 21.37,19.07 13.5,11.2 13.5,7.54 X6.1
VPH
  Bottom 0.4: B1.22 130.17,19.69 130.32,19.69 144.34,5.67 145.89,5.67 147.4,7.18 C7.1 158.45,6.1 164.8,6.1 167.51,6.1 IC4.6 IC4.7
VREF
  Bottom 0.4: R4.1 157.97,24.42 156.71,23.16 155.49,23.16 153.14,25.51 IC2.2
VSENSOR
  Bottom 0.61: X2.1 177.12,54.48 182.12,49.48 192.12,49.48 193.19,48.41 193.19,31.32 190.84,28.96 164.13,28.96 IC3.2
(copper drawn outside any net)
  shapes: Bottom area x1